# EasyEDA Pro project pcb_02.epro

# Board PCB1
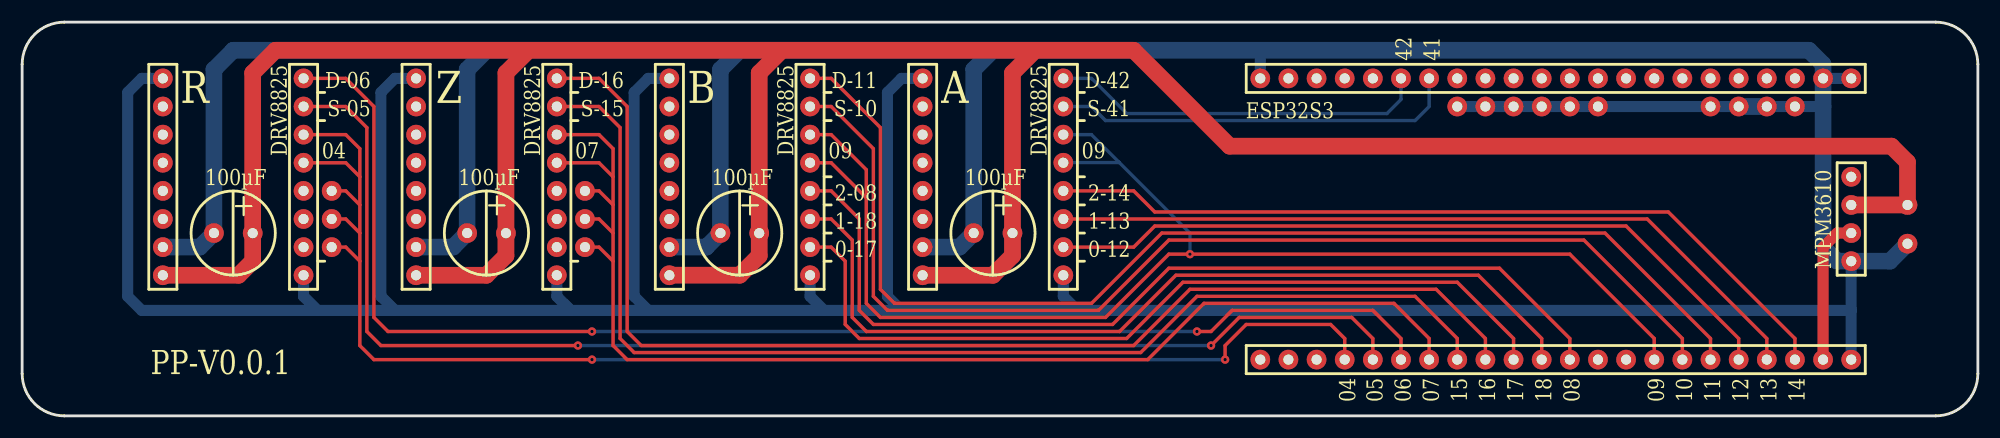
[diagram p0: board, top side]
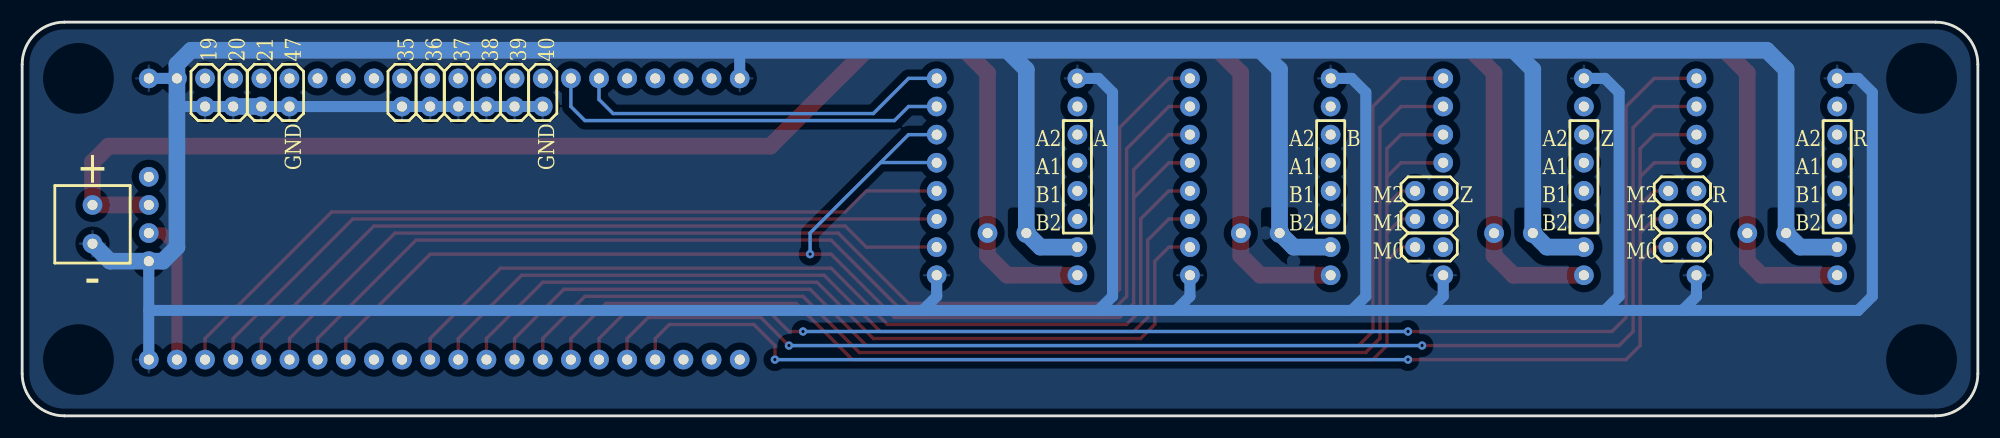
[diagram p1: board, bottom side, seen from below]

Outline 176.53 x 35.56 mm; copper layers: Top Layer, Bottom Layer. Coordinates in mm from the lower left corner of the outline.
Outline path: 0,31.75 arc(1.12,34.44) 3.81,35.56 172.72,35.56 arc(175.41,34.44) 176.53,31.75 176.53,3.81 arc(175.41,1.12) 172.72,0 3.81,0 arc(1.12,1.12) 0,3.81 0,31.75
Stack: Top Layer 0.035mm / Dielectric1 1.51mm FR4 er 4.5 / Bottom Layer 0.035mm

## Design rules (mm)
template: JLCPCB Capability(Two Layers Board)
spacing copperThickness1oz (default): track to track 0.102, other pairs 0.152 to 0.3
spacing copperThickness2oz: track to track 0.203, other pairs 0.152 to 0.3
track width copperThickness1oz (default): min 0.127, default 0.254, max 2.54
track width copperThickness2oz: min 0.203, default 0.254, max 2.54
differential pair differentialPair (default): width min 0.127, default 0.254, max 2.54; gap min 0.152, default 0.152
via viaSize (default): diameter min 0.5, default 0.61, max 10; hole min 0.3, default 0.305, max 6.3

## Placement (name value [footprint] x y rotation side)
NOREF  -  [Pad_e176]  81.28 15.24 270 top
NOREF#2  -  [Pad_e173]  81.28 22.86 270 top
NOREF#3  -  [Pad_e501]  58.42 27.94 270 top
NOREF#4  -  [Pad_e68]  119.38 30.48 270 top
NOREF#5  -  [Pad_e882]  132.08 27.94 270 top
NOREF#6  -  [Pad_e1564]  35.56 15.24 270 top
NOREF#7  -  [Pad_e41]  132.08 5.08 270 top
NOREF#8  -  [Pad_e2025]  25.4 27.94 270 top
NOREF#9  -  [Pad_e1674]  50.8 20.32 270 top
NOREF#10  -  [Pad_e1571]  48.26 30.48 270 top
NOREF#11  -  [Pad_e100]  170.18 19.05 0 top
NOREF#12  -  [Pad_e2035]  12.7 27.94 270 top
NOREF#13  -  [Pad_e50]  165.1 30.48 270 top
NOREF#14  -  [Pad_e221]  152.4 27.94 270 top
NOREF#15  -  [Pad_e228]  129.54 27.94 270 top
NOREF#16  -  [Pad_e1561]  43.67 16.5 270 top
NOREF#17  -  [Pad_e1560]  48.26 17.78 270 top
NOREF#18  -  [Pad_e58]  144.78 30.48 270 top
NOREF#19  -  [Pad_e56]  149.86 30.48 270 top
NOREF#20  -  [Pad_e167]  93.98 20.32 270 top
NOREF#21  -  [Pad_e492]  71.12 30.48 270 top
NOREF#22  -  [Pad_e177]  81.28 12.7 270 top
NOREF#23  -  [Pad_e33]  152.4 5.08 270 top
NOREF#24  -  [Pad_e53]  157.48 30.48 270 top
NOREF#25  -  [Pad_e69]  116.84 30.48 270 top
NOREF#26  -  [Pad_e171]  81.28 27.94 270 top
NOREF#27  -  [Pad_e29]  162.56 5.08 270 top
NOREF#28  -  [Pad_e487]  71.12 17.78 270 top
NOREF#29  -  [Pad_e2024]  25.4 30.48 270 top
NOREF#30  -  [Pad_e31]  157.48 5.08 270 top
NOREF#31  -  [Pad_e497]  58.42 17.78 270 top
NOREF#32  -  [Pad_e39]  137.16 5.08 270 top
NOREF#33  -  [Pad_e1562]  40.17 16.51 270 top
NOREF#34  -  [Pad_e502]  58.42 30.48 270 top
NOREF#35  -  [Pad_e66]  124.46 30.48 270 top
NOREF#36  -  [Pad_e2038]  12.7 20.32 270 top
NOREF#37  -  [Pad_e2040]  12.7 15.24 270 top
NOREF#38  -  [Pad_e1574]  48.26 22.86 270 top
NOREF#39  -  [Pad_e47]  116.84 5.08 270 top
NOREF#40  -  [Pad_e169]  93.98 15.24 270 top
NOREF#41  -  [Pad_e65]  127 30.48 270 top
NOREF#42  -  [Pad_e34]  149.86 5.08 270 top
NOREF#43  -  [Pad_e491]  71.12 27.94 270 top
NOREF#44  -  [Pad_e43]  127 5.08 270 top
NOREF#45  -  [Pad_e1573]  48.26 25.4 270 top
NOREF#46  -  [Pad_e36]  144.78 5.08 270 top
NOREF#47  -  [Pad_e877]  139.7 27.94 270 top
NOREF#48  -  [Pad_e1569]  35.56 27.94 270 top
NOREF#49  -  [Pad_e1568]  35.56 25.4 270 top
NOREF#50  -  [Pad_e298]  89.39 16.51 270 top
NOREF#51  -  [Pad_e498]  58.42 20.32 270 top
NOREF#52  -  [Pad_e40]  134.62 5.08 270 top
NOREF#53  -  [Pad_e38]  139.7 5.08 270 top
NOREF#54  -  [Pad_e1673]  50.8 17.78 270 top
NOREF#55  -  [Pad_e1672]  50.8 15.24 270 top
NOREF#56  -  [Pad_e57]  147.32 30.48 270 top
NOREF#57  -  [Pad_e489]  71.12 22.86 270 top
NOREF#58  -  [Pad_e32]  154.94 5.08 270 top
NOREF#59  -  [Pad_e2037]  12.7 22.86 270 top
NOREF#60  -  [Pad_e2033]  17.31 16.51 270 top
NOREF#61  -  [Pad_e2021]  27.94 15.24 270 top
NOREF#62  -  [Pad_e485]  71.12 12.7 270 top
NOREF#63  -  [Pad_e218]  160.02 27.94 270 top
NOREF#64  -  [Pad_e74]  165.1 19.05 0 top
NOREF#65  -  [Pad_e55]  152.4 30.48 270 top
NOREF#66  -  [Pad_e35]  147.32 5.08 270 top
NOREF#67  -  [Pad_e488]  71.12 20.32 270 top
NOREF#68  -  [Pad_e494]  63.03 16.51 270 top
NOREF#69  -  [Pad_e72]  165.1 13.97 270 top
NOREF#70  -  [Pad_e871]  154.94 27.94 270 top
NOREF#71  -  [Pad_e2032]  20.81 16.5 270 top
NOREF#72  -  [Pad_e1570]  35.56 30.48 270 top
NOREF#73  -  [Pad_e174]  81.28 20.32 270 top
NOREF#74  -  [Pad_e2031]  25.4 12.7 270 top
NOREF#75  -  [Pad_e1572]  48.26 27.94 270 top
NOREF#76  -  [Pad_e60]  139.7 30.48 270 top
NOREF#77  -  [Pad_e1566]  35.56 20.32 270 top
NOREF#78  -  [Pad_e168]  93.98 17.78 270 top
NOREF#79  -  [Pad_e872]  157.48 27.94 270 top
NOREF#80  -  [Pad_e170]  93.98 12.7 270 top
NOREF#81  -  [Pad_e224]  137.16 27.94 270 top
NOREF#82  -  [Pad_e1565]  35.56 17.78 270 top
NOREF#83  -  [Pad_e1563]  35.56 12.7 270 top
NOREF#84  -  [Pad_e1559]  48.26 15.24 270 top
NOREF#85  -  [Pad_e495]  58.42 12.7 270 top
NOREF#86  -  [Pad_e112]  170.18 15.55 0 top
NOREF#87  -  [Pad_e1567]  35.56 22.86 270 top
NOREF#88  -  [Pad_e62]  134.62 30.48 270 top
NOREF#89  -  [Pad_e2027]  25.4 22.86 270 top
NOREF#90  -  [Pad_e304]  85.89 16.51 270 top
NOREF#91  -  [Pad_e46]  119.38 5.08 270 top
NOREF#92  -  [Pad_e161]  93.98 30.48 270 top
NOREF#93  -  [Pad_e44]  124.46 5.08 270 top
NOREF#94  -  [Pad_e2022]  27.94 17.78 270 top
NOREF#95  -  [Pad_e876]  142.24 27.94 270 top
NOREF#96  -  [Pad_e493]  66.53 16.5 270 top
NOREF#97  -  [Pad_e2030]  25.4 15.24 270 top
NOREF#98  -  [Pad_e1575]  48.26 20.32 270 top
NOREF#99  -  [Pad_e54]  154.94 30.48 270 top
NOREF#100  -  [Pad_e48]  114.3 5.08 270 top
NOREF#101  -  [Pad_e2041]  12.7 12.7 270 top
NOREF#102  -  [Pad_e172]  81.28 25.4 270 top
NOREF#103  -  [Pad_e881]  134.62 27.94 270 top
NOREF#104  -  [Pad_e52]  160.02 30.48 270 top
NOREF#105  -  [Pad_e2036]  12.7 25.4 270 top
NOREF#106  -  [Pad_e71]  111.76 30.48 270 top
NOREF#107  -  [Pad_e73]  165.1 16.51 270 top
NOREF#108  -  [Pad_e61]  137.16 30.48 270 top
NOREF#109  -  [Pad_e51]  162.56 30.48 270 top
NOREF#110  -  [Pad_e63]  132.08 30.48 270 top
NOREF#111  -  [Pad_e486]  71.12 15.24 270 top
NOREF#112  -  [Pad_e175]  81.28 17.78 270 top
NOREF#113  -  [Pad_e1558]  48.26 12.7 270 top
NOREF#114  -  [Pad_e2023]  27.94 20.32 270 top
NOREF#115  -  [Pad_e49]  111.76 5.08 270 top
NOREF#116  -  [Pad_e59]  142.24 30.48 270 top
NOREF#117  -  [Pad_e37]  142.24 5.08 270 top
NOREF#118  -  [Pad_e2029]  25.4 17.78 270 top
NOREF#119  -  [Pad_e178]  81.28 30.48 270 top
NOREF#120  -  [Pad_e64]  129.54 30.48 270 top
NOREF#121  -  [Pad_e45]  121.92 5.08 270 top
NOREF#122  -  [Pad_e2034]  12.7 30.48 270 top
NOREF#123  -  [Pad_e23]  165.1 5.08 270 top
NOREF#124  -  [Pad_e42]  129.54 5.08 0 top
NOREF#125  -  [Pad_e75]  165.1 21.59 270 top
NOREF#126  -  [Pad_e70]  114.3 30.48 270 top
NOREF#127  -  [Pad_e2028]  25.4 20.32 270 top
NOREF#128  -  [Pad_e496]  58.42 15.24 270 top
NOREF#129  -  [Pad_e2039]  12.7 17.78 270 top
NOREF#130  -  [Pad_e165]  93.98 25.4 270 top
NOREF#131  -  [Pad_e499]  58.42 22.86 270 top
NOREF#132  -  [Pad_e490]  71.12 25.4 270 top
NOREF#133  -  [Pad_e164]  93.98 27.94 270 top
NOREF#134  -  [Pad_e30]  160.02 5.08 270 top
NOREF#135  -  [Pad_e500]  58.42 25.4 270 top
NOREF#136  -  [Pad_e67]  121.92 30.48 270 top
NOREF#137  -  [Pad_e166]  93.98 22.86 270 top
NOREF#138  -  [Pad_e2026]  25.4 25.4 270 top

## Footprints (pads in the part's own frame, mm; a bottom-side part is the same pattern mirrored in y, then rotated)
Pad_e23
  round 1.778 hole 0.914: GND(0,0)
Pad_e29
  round 1.778 hole 0.914: 5V(0,0)
Pad_e30
  round 1.778 hole 0.914: 14(0,0)
Pad_e31
  round 1.778 hole 0.914: 13(0,0)
Pad_e32
  round 1.778 hole 0.914: 12(0,0)
Pad_e33
  round 1.778 hole 0.914: 11(0,0)
Pad_e34
  round 1.778 hole 0.914: 10(0,0)
Pad_e35
  round 1.778 hole 0.914: 9(0,0)
Pad_e36
  round 1.778 hole 0.914: 46(0,0)
Pad_e37
  round 1.778 hole 0.914: 3(0,0)
Pad_e38
  round 1.778 hole 0.914: 8(0,0)
Pad_e39
  round 1.778 hole 0.914: 18(0,0)
Pad_e40
  round 1.778 hole 0.914: 17(0,0)
Pad_e41
  round 1.778 hole 0.914: 16(0,0)
Pad_e42
  round 1.778 hole 0.914: 15(0,0)
Pad_e43
  round 1.778 hole 0.914: 7(0,0)
Pad_e44
  round 1.778 hole 0.914: 6(0,0)
Pad_e45
  round 1.778 hole 0.914: 5(0,0)
Pad_e46
  round 1.778 hole 0.914: 4(0,0)
Pad_e47
  round 1.778 hole 0.914: RST(0,0)
Pad_e48
  round 1.778 hole 0.914: 3V3(0,0)
Pad_e49
  round 1.778 hole 0.914: 3V3(0,0)
Pad_e50
  round 1.778 hole 0.914: GND(0,0)
Pad_e51
  round 1.778 hole 0.914: GND(0,0)
Pad_e52
  round 1.778 hole 0.914: 19(0,0)
Pad_e53
  round 1.778 hole 0.914: 20(0,0)
Pad_e54
  round 1.778 hole 0.914: 21(0,0)
Pad_e55
  round 1.778 hole 0.914: 47(0,0)
Pad_e56
  round 1.778 hole 0.914: 48(0,0)
Pad_e57
  round 1.778 hole 0.914: 45(0,0)
Pad_e58
  round 1.778 hole 0.914: 0(0,0)
Pad_e59
  round 1.778 hole 0.914: 35(0,0)
Pad_e60
  round 1.778 hole 0.914: 36(0,0)
Pad_e61
  round 1.778 hole 0.914: 37(0,0)
Pad_e62
  round 1.778 hole 0.914: 38(0,0)
Pad_e63
  round 1.778 hole 0.914: 39(0,0)
Pad_e64
  round 1.778 hole 0.914: 40(0,0)
Pad_e65
  round 1.778 hole 0.914: 41(0,0)
Pad_e66
  round 1.778 hole 0.914: 42(0,0)
Pad_e67
  round 1.778 hole 0.914: 2(0,0)
Pad_e68
  round 1.778 hole 0.914: 1(0,0)
Pad_e69
  round 1.778 hole 0.914: RX(0,0)
Pad_e70
  round 1.778 hole 0.914: TX(0,0)
Pad_e71
  round 1.778 hole 0.914: GND(0,0)
Pad_e72
  round 1.778 hole 0.914: GND(0,0)
Pad_e73
  round 1.778 hole 0.914: 5V(0,0)
Pad_e74
  round 1.778 hole 0.914: VIN(0,0)
Pad_e75
  round 1.778 hole 0.914: EN(0,0)
Pad_e100
  round 1.778 hole 0.914: (0,0)
Pad_e112
  round 1.778 hole 0.914: (0,0)
Pad_e161
  round 1.778 hole 0.914: 1524(0,0)
Pad_e164
  round 1.778 hole 0.914: 1524(0,0)
Pad_e165
  round 1.778 hole 0.914: 1524(0,0)
Pad_e166
  round 1.778 hole 0.914: 1524(0,0)
Pad_e167
  round 1.778 hole 0.914: 1524(0,0)
Pad_e168
  round 1.778 hole 0.914: 1524(0,0)
Pad_e169
  round 1.778 hole 0.914: 1524(0,0)
Pad_e170
  round 1.778 hole 0.914: 1524(0,0)
Pad_e171
  round 1.778 hole 0.914: 1524(0,0)
Pad_e172
  round 1.778 hole 0.914: 1524(0,0)
Pad_e173
  round 1.778 hole 0.914: 1524(0,0)
Pad_e174
  round 1.778 hole 0.914: 1524(0,0)
Pad_e175
  round 1.778 hole 0.914: 1524(0,0)
Pad_e176
  round 1.778 hole 0.914: 1524(0,0)
Pad_e177
  round 1.778 hole 0.914: 1524(0,0)
Pad_e178
  round 1.778 hole 0.914: 1524(0,0)
Pad_e218
  round 1.778 hole 0.914: GND(0,0)
Pad_e221
  round 1.778 hole 0.914: GND(0,0)
Pad_e224
  round 1.778 hole 0.914: GND(0,0)
Pad_e228
  round 1.778 hole 0.914: GND(0,0)
Pad_e298
  round 1.778 hole 0.914: 1524(0,0)
Pad_e304
  round 1.778 hole 0.914: 1524(0,0)
Pad_e485
  round 1.778 hole 0.914: 1524(0,0)
Pad_e486
  round 1.778 hole 0.914: 1524(0,0)
Pad_e487
  round 1.778 hole 0.914: 1524(0,0)
Pad_e488
  round 1.778 hole 0.914: 1524(0,0)
Pad_e489
  round 1.778 hole 0.914: 1524(0,0)
Pad_e490
  round 1.778 hole 0.914: 1524(0,0)
Pad_e491
  round 1.778 hole 0.914: 1524(0,0)
Pad_e492
  round 1.778 hole 0.914: 1524(0,0)
Pad_e493
  round 1.778 hole 0.914: 1524(0,0)
Pad_e494
  round 1.778 hole 0.914: 1524(0,0)
Pad_e495
  round 1.778 hole 0.914: 1524(0,0)
Pad_e496
  round 1.778 hole 0.914: 1524(0,0)
Pad_e497
  round 1.778 hole 0.914: 1524(0,0)
Pad_e498
  round 1.778 hole 0.914: 1524(0,0)
Pad_e499
  round 1.778 hole 0.914: 1524(0,0)
Pad_e500
  round 1.778 hole 0.914: 1524(0,0)
Pad_e501
  round 1.778 hole 0.914: 1524(0,0)
Pad_e502
  round 1.778 hole 0.914: 1524(0,0)
Pad_e871
  round 1.778 hole 0.914: GND(0,0)
Pad_e872
  round 1.778 hole 0.914: GND(0,0)
Pad_e876
  round 1.778 hole 0.914: GND(0,0)
Pad_e877
  round 1.778 hole 0.914: GND(0,0)
Pad_e881
  round 1.778 hole 0.914: GND(0,0)
Pad_e882
  round 1.778 hole 0.914: GND(0,0)
Pad_e1558
  round 1.778 hole 0.914: 1524(0,0)
Pad_e1559
  round 1.778 hole 0.914: 1524(0,0)
Pad_e1560
  round 1.778 hole 0.914: 1524(0,0)
Pad_e1561
  round 1.778 hole 0.914: 1524(0,0)
Pad_e1562
  round 1.778 hole 0.914: 1524(0,0)
Pad_e1563
  round 1.778 hole 0.914: 1524(0,0)
Pad_e1564
  round 1.778 hole 0.914: 1524(0,0)
Pad_e1565
  round 1.778 hole 0.914: 1524(0,0)
Pad_e1566
  round 1.778 hole 0.914: 1524(0,0)
Pad_e1567
  round 1.778 hole 0.914: 1524(0,0)
Pad_e1568
  round 1.778 hole 0.914: 1524(0,0)
Pad_e1569
  round 1.778 hole 0.914: 1524(0,0)
Pad_e1570
  round 1.778 hole 0.914: 1524(0,0)
Pad_e1571
  round 1.778 hole 0.914: 1524(0,0)
Pad_e1572
  round 1.778 hole 0.914: 1524(0,0)
Pad_e1573
  round 1.778 hole 0.914: 1524(0,0)
Pad_e1574
  round 1.778 hole 0.914: 1524(0,0)
Pad_e1575
  round 1.778 hole 0.914: 1524(0,0)
Pad_e1672
  round 1.778 hole 0.914: 1524(0,0)
Pad_e1673
  round 1.778 hole 0.914: 1524(0,0)
Pad_e1674
  round 1.778 hole 0.914: 1524(0,0)
Pad_e2021
  round 1.778 hole 0.914: 1524(0,0)
Pad_e2022
  round 1.778 hole 0.914: 1524(0,0)
Pad_e2023
  round 1.778 hole 0.914: 1524(0,0)
Pad_e2024
  round 1.778 hole 0.914: 1524(0,0)
Pad_e2025
  round 1.778 hole 0.914: 1524(0,0)
Pad_e2026
  round 1.778 hole 0.914: 1524(0,0)
Pad_e2027
  round 1.778 hole 0.914: 1524(0,0)
Pad_e2028
  round 1.778 hole 0.914: 1524(0,0)
Pad_e2029
  round 1.778 hole 0.914: 1524(0,0)
Pad_e2030
  round 1.778 hole 0.914: 1524(0,0)
Pad_e2031
  round 1.778 hole 0.914: 1524(0,0)
Pad_e2032
  round 1.778 hole 0.914: 1524(0,0)
Pad_e2033
  round 1.778 hole 0.914: 1524(0,0)
Pad_e2034
  round 1.778 hole 0.914: 1524(0,0)
Pad_e2035
  round 1.778 hole 0.914: 1524(0,0)
Pad_e2036
  round 1.778 hole 0.914: 1524(0,0)
Pad_e2037
  round 1.778 hole 0.914: 1524(0,0)
Pad_e2038
  round 1.778 hole 0.914: 1524(0,0)
Pad_e2039
  round 1.778 hole 0.914: 1524(0,0)
Pad_e2040
  round 1.778 hole 0.914: 1524(0,0)
Pad_e2041
  round 1.778 hole 0.914: 1524(0,0)

## Nets
5V: NOREF#27.5V NOREF#107.5V
12V: NOREF#11. NOREF#16.1524 NOREF#22.1524 NOREF#50.1524 NOREF#64.VIN NOREF#71.1524 NOREF#83.1524 NOREF#85.1524 NOREF#96.1524 NOREF#101.1524
GND: NOREF.1524 NOREF#5.GND NOREF#6.1524 NOREF#13.GND NOREF#14.GND NOREF#15.GND NOREF#33.1524 NOREF#34.1524 NOREF#37.1524 NOREF#47.GND NOREF#60.1524 NOREF#62.1524 NOREF#63.GND NOREF#68.1524 NOREF#69.GND NOREF#70.GND NOREF#72.1524 NOREF#74.1524 NOREF#79.GND NOREF#80.1524 NOREF#81.GND NOREF#86. NOREF#90.1524 NOREF#95.GND NOREF#103.GND NOREF#106.GND NOREF#109.GND NOREF#113.1524 NOREF#119.1524 NOREF#122.1524 NOREF#123.GND NOREF#128.1524
B_EN: NOREF#125.EN
M_A1: NOREF#59.1524
M_A2: NOREF#105.1524
M_B1: NOREF#36.1524
M_B2: NOREF#129.1524
M_DIR: NOREF#29.1524 NOREF#93.6
M_EN: NOREF#61.1524 NOREF#89.1524 NOREF#91.4 NOREF#94.1524 NOREF#114.1524 NOREF#138.1524
M_M0: NOREF#97.1524
M_M1: NOREF#118.1524
M_M2: NOREF#127.1524
M_STP: NOREF#8.1524 NOREF#121.5
X_A1: NOREF#2.1524
X_A2: NOREF#102.1524
X_B1: NOREF#73.1524
X_B2: NOREF#112.1524
X_DIR: NOREF#35.42 NOREF#92.1524
X_M0: NOREF#40.1524 NOREF#58.12
X_M1: NOREF#30.13 NOREF#78.1524
X_M2: NOREF#20.1524 NOREF#134.14
X_STP: NOREF#41.41 NOREF#133.1524
XY_EN: NOREF#57.1524 NOREF#66.9 NOREF#130.1524 NOREF#132.1524 NOREF#137.1524
Y_A1: NOREF#131.1524
Y_A2: NOREF#135.1524
Y_B1: NOREF#51.1524
Y_B2: NOREF#31.1524
Y_DIR: NOREF#21.1524 NOREF#23.11
Y_M0: NOREF#52.17 NOREF#111.1524
Y_M1: NOREF#28.1524 NOREF#32.18
Y_M2: NOREF#53.8 NOREF#67.1524
Y_STP: NOREF#42.10 NOREF#43.1524
Z_A1: NOREF#87.1524
Z_A2: NOREF#49.1524
Z_B1: NOREF#77.1524
Z_B2: NOREF#82.1524
Z_DIR: NOREF#7.16 NOREF#10.1524
Z_EN: NOREF#9.1524 NOREF#38.1524 NOREF#44.7 NOREF#45.1524 NOREF#54.1524 NOREF#55.1524
Z_M0: NOREF#84.1524
Z_M1: NOREF#17.1524
Z_M2: NOREF#98.1524
Z_STP: NOREF#75.1524 NOREF#124.15

Pads without a net: NOREF#3 1524; NOREF#4 1; NOREF#12 1524; NOREF#18 0; NOREF#19 48; NOREF#24 20; NOREF#25 RX; NOREF#26 1524; NOREF#39 RST; NOREF#46 46; NOREF#48 1524; NOREF#56 45; NOREF#65 47; NOREF#76 36; NOREF#88 38; NOREF#99 21; NOREF#100 3V3; NOREF#104 19; NOREF#108 37; NOREF#110 39; NOREF#115 3V3; NOREF#116 35; NOREF#117 3; NOREF#120 40; NOREF#126 TX; NOREF#136 2

## Via types
v1: diameter 0.75, hole 0.305, Top Layer to Bottom Layer, 7 vias

## Routing (per net, layer and track width the routed paths; a pad name or vN(x,y) marks a point on that pad's centre or on a via; arc(x,y) is an arc through that point)
5V: length 13.2
  Top Layer w1: NOREF#107.5V 163.83,16.51 162.56,15.24 NOREF#27.5V
12V: length 273.7
  Top Layer w1.5: 91.44,33.02 89.39,30.97 NOREF#50.1524 89.39,14.46 87.63,12.7 NOREF#22.1524 ; 91.44,33.02 68.58,33.02 ; 91.44,33.02 100.33,33.02 108.99,24.36 168.73,24.36 170.18,22.91 170.18,19.05 NOREF#64.VIN ; NOREF#83.1524 41.91,12.7 43.67,14.46 NOREF#16.1524 43.67,30.97 45.72,33.02 ; 68.58,33.02 66.53,30.97 NOREF#96.1524 66.53,14.46 64.77,12.7 58.42,12.7 NOREF#85.1524 ; 68.58,33.02 45.72,33.02 ; 45.72,33.02 22.86,33.02 20.81,30.97 NOREF#71.1524 20.81,13.97 19.54,12.7 NOREF#101.1524
GND: length 570.6
  Bottom Layer w1: NOREF#79.GND NOREF#63.GND 162.56,27.94 ; 49.53,9.53 48.26,10.8 NOREF#113.1524 ; 49.53,9.53 49.53,9.52 ; 49.53,9.53 56.52,9.53 ; 49.53,9.53 33.66,9.53 ; 165.1,9.53 95.25,9.53 ; 165.1,9.53 NOREF#123.GND ; 165.1,9.53 NOREF#69.GND ; 95.25,9.53 79.38,9.53 ; 95.25,9.53 93.98,10.8 NOREF#80.1524 ; 79.38,9.53 78.1,10.8 78.1,29.21 79.38,30.48 NOREF#119.1524 ; 79.38,9.53 72.39,9.53 ; 26.67,9.53 33.66,9.53 ; 26.67,9.53 10.8,9.53 9.52,10.8 9.52,29.21 10.8,30.48 NOREF#122.1524 ; 26.67,9.53 25.4,10.8 NOREF#74.1524 ; 33.66,9.53 32.38,10.8 32.38,29.21 33.66,30.48 NOREF#72.1524 ; 56.52,9.53 72.39,9.53 ; 56.52,9.53 55.24,10.8 55.24,29.21 56.52,30.48 NOREF#34.1524 ; 72.39,9.53 71.12,10.8 NOREF#62.1524 ; NOREF#13.GND NOREF#109.GND ; NOREF#15.GND NOREF#5.GND NOREF#103.GND NOREF#81.GND NOREF#47.GND NOREF#95.GND NOREF#14.GND NOREF#70.GND ; NOREF#106.GND 111.76,33.02
  Bottom Layer w1.5: 64.77,33.02 63.03,31.28 NOREF#68.1524 61.76,15.24 NOREF#128.1524 ; 64.77,33.02 87.63,33.02 ; 64.77,33.02 41.91,33.02 ; 170.18,15.55 168.6,13.97 NOREF#69.GND 163.83,13.97 162.56,15.24 NOREF#109.GND 162.56,31.75 161.29,33.02 87.63,33.02 ; 87.63,33.02 85.89,31.28 NOREF#90.1524 84.62,15.24 NOREF.1524 ; 41.91,33.02 19.05,33.02 17.31,31.28 NOREF#60.1524 16.04,15.24 NOREF#37.1524 ; 41.91,33.02 40.17,31.28 NOREF#33.1524 38.9,15.24 NOREF#6.1524 ; NOREF#70.GND NOREF#79.GND
M_DIR: length 123.4
  Top Layer w0.305: v1(51.44,7.62) 33.02,7.62 31.75,8.89 31.75,27.94 29.21,30.48 NOREF#29.1524 ; NOREF#93.6 124.46,6.98 121.92,9.53 109.22,9.53 107.31,7.62 v1(106.04,7.62)
  Bottom Layer w0.305: v1(51.44,7.62) v1(106.04,7.62)
M_EN: length 132.1
  Top Layer w0.305: 30.48,19.05 29.21,20.32 NOREF#114.1524 ; 30.48,19.05 30.48,21.59 ; 30.48,19.05 30.48,16.51 ; 30.48,13.97 30.48,6.35 31.75,5.08 v1(51.44,5.08) ; 30.48,13.97 29.21,15.24 NOREF#61.1524 ; 30.48,13.97 30.48,16.51 ; 30.48,21.59 29.21,22.86 NOREF#89.1524 ; 30.48,21.59 30.48,24.13 29.21,25.4 NOREF#138.1524 ; 30.48,16.51 29.21,17.78 NOREF#94.1524 ; NOREF#91.4 119.38,6.98 118.11,8.25 110.49,8.25 108.59,6.35 v1(108.59,5.08)
  Bottom Layer w0.305: v1(51.44,5.08) v1(108.59,5.08)
M_STP: length 120
  Top Layer w0.305: v1(107.31,6.35) 109.85,8.89 120.01,8.89 121.92,6.98 NOREF#121.5 ; v1(50.16,6.35) 32.38,6.35 31.11,7.62 31.11,26.03 29.21,27.94 NOREF#8.1524
  Bottom Layer w0.305: v1(50.16,6.35) v1(107.31,6.35)
X_DIR: length 34.2
  Bottom Layer w0.305: NOREF#92.1524 96.52,30.48 99.69,27.31 123.19,27.31 124.46,28.58 NOREF#35.42
X_M0: length 67.9
  Top Layer w0.305: NOREF#40.1524 100.33,15.24 102.23,17.14 144.78,17.14 154.94,6.98 NOREF#58.12
X_M1: length 69.9
  Top Layer w0.305: NOREF#78.1524 146.69,17.78 157.48,6.98 NOREF#30.13
X_M2: length 73.5
  Top Layer w0.305: NOREF#20.1524 100.33,20.32 102.23,18.42 148.59,18.42 160.02,6.98 NOREF#134.14
X_STP: length 36.6
  Bottom Layer w0.305: NOREF#41.41 127,27.94 125.73,26.67 97.79,26.67 96.52,27.94 NOREF#133.1524
XY_EN: length 126
  Top Layer w0.305: 76.2,19.69 76.2,22.22 73.03,25.4 NOREF#132.1524 ; 76.2,19.69 73.03,22.86 NOREF#57.1524 ; 76.2,19.69 76.2,10.16 77.47,8.89 97.79,8.89 103.5,14.61 v1(105.41,14.61) 139.7,14.61 147.32,6.98 NOREF#66.9
  Bottom Layer w0.305: NOREF#130.1524 96.52,25.4 99.04,22.88 ; 99.04,22.88 94,22.88 NOREF#137.1524 ; 99.04,22.88 105.41,16.51 v1(105.41,14.61)
Y_DIR: length 106.7
  Top Layer w0.305: NOREF#21.1524 73.03,30.48 77.47,26.03 77.47,11.43 78.74,10.16 96.52,10.16 102.87,16.51 142.88,16.51 152.4,6.98 NOREF#23.11
Y_M0: length 76.4
  Top Layer w0.305: NOREF#52.17 134.62,6.98 129.54,12.06 104.78,12.06 99.69,6.98 75.56,6.98 74.29,8.25 74.29,13.97 73.03,15.24 NOREF#111.1524
Y_M1: length 80.7
  Top Layer w0.305: NOREF#32.18 137.16,6.98 131.44,12.7 104.14,12.7 99.06,7.62 76.2,7.62 74.93,8.89 74.93,15.88 73.03,17.78 NOREF#28.1524
Y_M2: length 85.1
  Top Layer w0.305: NOREF#67.1524 73.03,20.32 75.56,17.78 75.56,9.53 76.84,8.25 98.42,8.25 103.5,13.33 133.35,13.33 139.7,6.98 NOREF#53.8
Y_STP: length 102.4
  Top Layer w0.305: NOREF#43.1524 73.03,27.94 76.84,24.13 76.84,10.8 78.1,9.53 97.16,9.53 103.5,15.88 140.97,15.88 149.86,6.98 NOREF#42.10
Z_DIR: length 111.6
  Top Layer w0.305: NOREF#10.1524 52.07,30.48 54.61,27.94 54.61,7.62 55.88,6.35 100.33,6.35 105.41,11.43 127.63,11.43 132.08,6.98 NOREF#7.16
Z_EN: length 117.7
  Top Layer w0.305: 53.34,19.05 53.34,21.59 ; 53.34,19.05 52.07,20.32 NOREF#9.1524 ; 53.34,19.05 53.34,16.51 ; 53.34,21.59 53.34,24.13 52.07,25.4 NOREF#45.1524 ; 53.34,21.59 52.07,22.86 NOREF#38.1524 ; 53.34,13.97 53.34,16.51 ; 53.34,13.97 52.07,15.24 NOREF#55.1524 ; 53.34,13.97 53.34,6.35 54.61,5.08 101.6,5.08 106.68,10.16 123.82,10.16 127,6.98 NOREF#44.7 ; 53.34,16.51 52.07,17.78 NOREF#54.1524
Z_STP: length 107.2
  Top Layer w0.305: NOREF#75.1524 52.07,27.94 53.97,26.03 53.97,6.98 55.24,5.72 100.97,5.72 106.04,10.8 125.73,10.8 129.54,6.98 NOREF#124.15

## Copper pours and planes (outline as drawn; the poured copper is in the pictures)
GND on Bottom Layer: 182.88,-6.35 -5.08,-6.35 -5.08,44.45 182.88,44.45

## Text on the board
Bottom Silkscreen Layer: R | Z | B | A | 40 | 39 | 38 | 37 | 36 | 35 | 47 | 21 | GND | M2 | M1 | M0 | A2 | A1 | B1 | B2 | 20 | 19 | + | -
Document Layer: MOD/EN | STP | DIR | MOD | EN
Top Silkscreen Layer: + | 04 | 05 | 06 | 07 | 15 | 16 | 17 | 18 | 08 | 09 | 10 | 11 | 12 | 13 | 14 | DRV8825 | MPM3610 | 42 | 41 | 100µF | D-06 | S-05 | D-16 | S-15 | D-11 | S-10 | 2-08 | 1-18 | 0-17 | D-42 | S-41 | 2-14 | 1-13 | 0-12 | ESP32S3 | PP-V0.0.1 | R | Z | B | A
